# Altium project Nixie_clock.PrjPcb
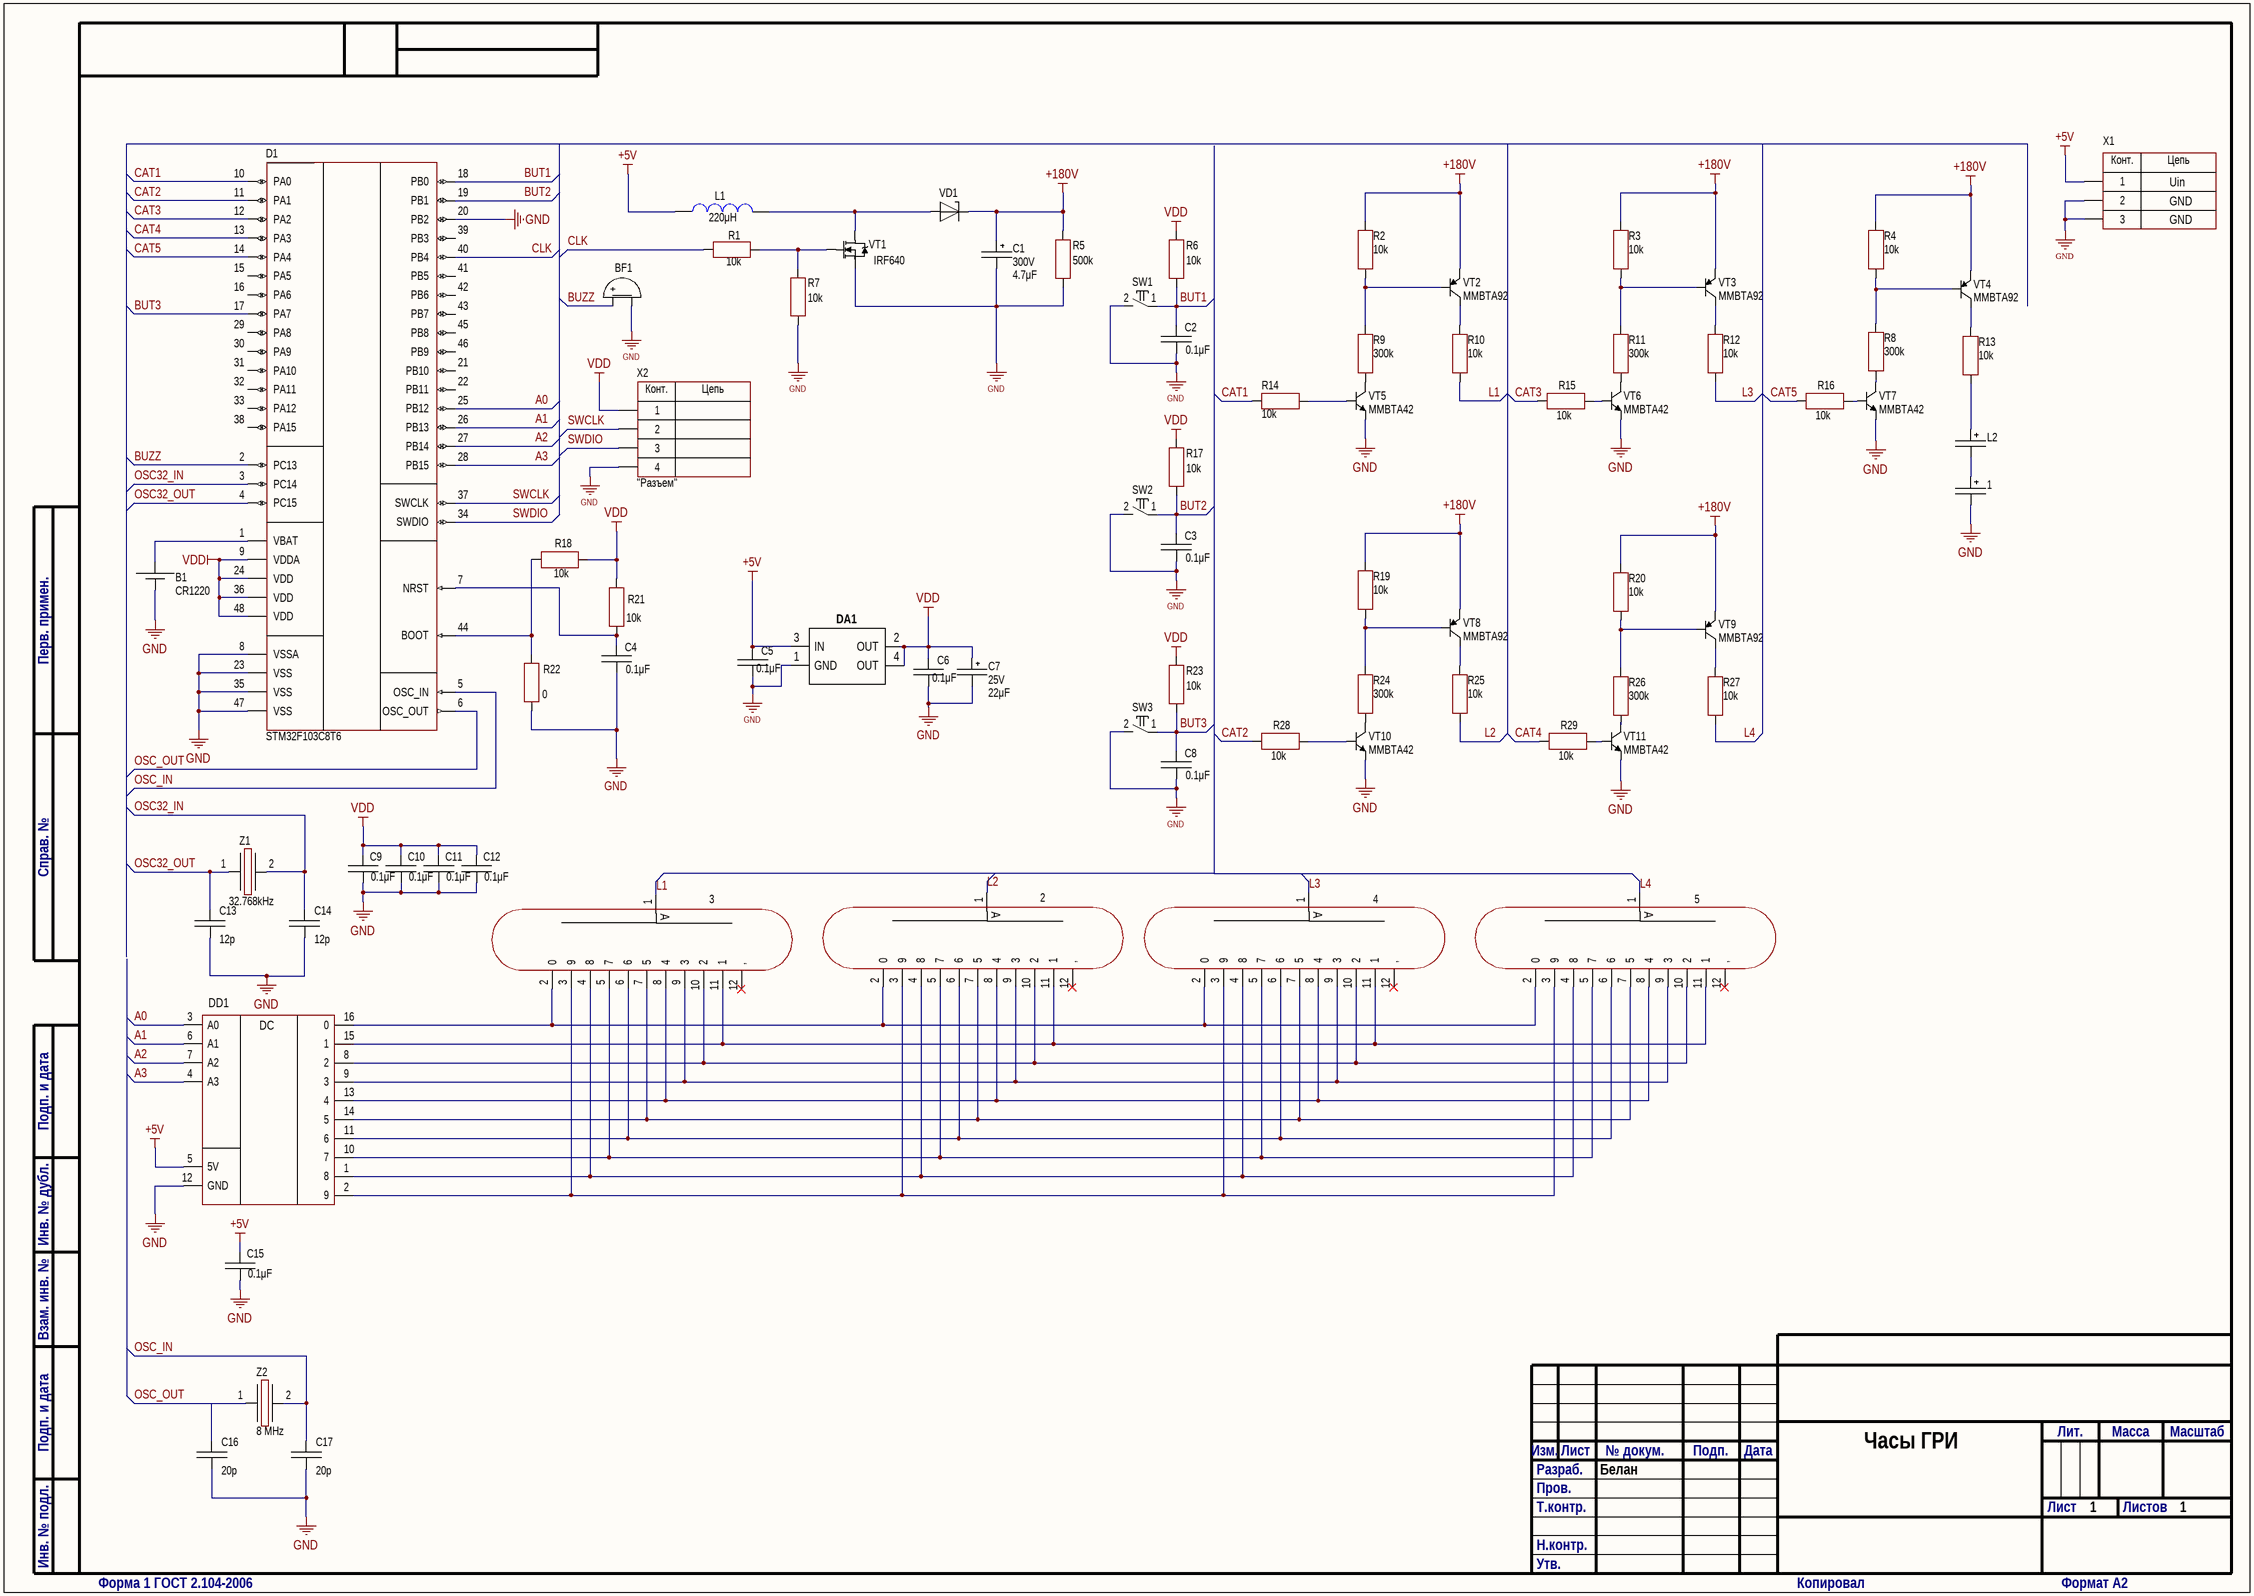
[diagram p0: NixieClock.SchDoc]
1 sheet, 77 parts. Net scope: global (net labels, ports and power ports of the same name join across sheets).
Board file: NixieClock.PcbDoc

## Sheet NixieClock.SchDoc: Часы ГРИ
size 594 x 420 mm; Author: Белан; SheetNumber: 1; SheetTotal: 1

### Parts
1  (no value)  [CAP: D5C2H11]
2  IN-12  (value not drawn)
3  IN-12  (value not drawn)
4  IN-12  (value not drawn)
5  IN-12  (value not drawn)
B1  CommentText: CR1220  [BAT: CR1220]
BF1  (no value)  [BUZ: AI-1223-TWT-3V-2-R]
C1  value 4.7μF  Voltage: 300V  [CAP: D8C3.5H12]
C2  value 0.1μF  [CAP: 0805]
C3  value 0.1μF  [CAP: 0805]
C4  value 0.1μF  [CAP: 0805]
C5  value 0.1μF  [CAP: 0805]
C6  value 0.1μF  [CAP: 0805]
C7  value 22μF  Voltage: 25V  [CAP: TANTAL-C]
C8  value 0.1μF  [CAP: 0805]
C9  value 0.1μF  [CAP: 0805]
C10  value 0.1μF  [CAP: 0805]
C11  value 0.1μF  [CAP: 0805]
C12  value 0.1μF  [CAP: 0805]
C13  value 12p  [CAP: 0805]
C14  value 12p  [CAP: 0805]
C15  value 0.1μF  [CAP: 0805]
C16  value 20p  [CAP: 0805]
C17  value 20p  [CAP: 0805]
D1  (no value)  [48-LQFP]
DA1  SPX1117M3-3-3  [SOT-223]  (value not drawn)
DD1  K155ID1  [16-DIP]  (value not drawn)
L1  value 220μH  [IND: SDR1006]
L2  (no value)  [CAP: D5C2H11]
R1  value 10k  [RES: 0805]
R2  value 10k  [RES: 0805]
R3  value 10k  [RES: 0805]
R4  value 10k  [RES: 0805]
R5  value 500k  [RES: 0805]
R6  value 10k  [RES: 0805]
R7  value 10k  [RES: 0805]
R8  value 300k  [RES: 0805]
R9  value 300k  [RES: 0805]
R10  value 10k  [RES: 0805]
R11  value 300k  [RES: 0805]
R12  value 10k  [RES: 0805]
R13  value 10k  [RES: 0805]
R14  value 10k  [RES: 0805]
R15  value 10k  [RES: 0805]
R16  value 10k  [RES: 0805]
R17  value 10k  [RES: 0805]
R18  value 10k  [RES: 0805]
R19  value 10k  [RES: 0805]
R20  value 10k  [RES: 0805]
R21  value 10k  [RES: 0805]
R22  value 0  [RES: 0805]
R23  value 10k  [RES: 0805]
R24  value 300k  [RES: 0805]
R25  value 10k  [RES: 0805]
R26  value 300k  [RES: 0805]
R27  value 10k  [RES: 0805]
R28  value 10k  [RES: 0805]
R29  value 10k  [RES: 0805]
SW1  (no value)  [BUT: 6x6]
SW2  (no value)  [BUT: 6x6]
SW3  (no value)  [BUT: 6x6]
VD1  (no value)  [DIODE: SOD123]
VT1  PartNumber: IRF640  [D2PAK]
VT2  PartNumber: MMBTA92  [SOT23]
VT3  PartNumber: MMBTA92  [SOT23]
VT4  PartNumber: MMBTA92  [SOT23]
VT5  PartNumber: MMBTA42  [SOT23]
VT6  PartNumber: MMBTA42  [SOT23]
VT7  PartNumber: MMBTA42  [SOT23]
VT8  PartNumber: MMBTA92  [SOT23]
VT9  PartNumber: MMBTA92  [SOT23]
VT10  PartNumber: MMBTA42  [SOT23]
VT11  PartNumber: MMBTA42  [SOT23]
X1  (no value)  [KLS1-DC-025V]
X2  CommentText: "Разъем"  [CON: PLS-4]
Z1  Frequency: 32.768kHz  [OSC: 3215]
Z2  Frequency: 8 MHz  [OSC: 3215]

### Nets
+5V: C5.2 C15.2 DA1.3(IN) DD1.5(5V) L1.2 X1.1
+180V: C1.1 R2.2 R3.2 R4.2 R5.1 R19.2 R20.2 VD1.2(C) VT2.2(E) VT3.2(E) VT4.2(E) VT8.2(E) VT9.2(E)
GND: 1.2 B1.2(-) BF1.2(-) C1.2 C2.1 C3.1 C4.1 C5.1 C6.1 C7.2 C8.1 C9.1 C10.1 C11.1 C12.1 C13.1 C14.1 C15.1 C16.1 C17.1 D1.8(VSSA) D1.20(PB2) D1.23(VSS) D1.35(VSS) D1.47(VSS) DA1.1(GND) DD1.12(GND) R5.2 R7.2 R22.1 SW1.2 SW2.2 SW3.2 VT1.3(S) VT5.2(E) VT6.2(E) VT7.2(E) VT10.2(E) VT11.2(E) X1.2 X1.3 X2.4
VDD: C6.2 C7.1 C9.2 C10.2 C11.2 C12.2 D1.9(VDDA) D1.24(VDD) D1.36(VDD) D1.48(VDD) DA1.2(OUT) DA1.4(OUT) R6.1 R17.1 R18.2 R21.2 R23.1 X2.1
A0: D1.25(PB12) DD1.3(A0)
A1: D1.26(PB13) DD1.6(A1)
A2: D1.27(PB14) DD1.7(A2)
A3: D1.28(PB15) DD1.4(A3)
BUT1: C2.2 D1.18(PB0) R6.2 SW1.1
BUT2: C3.2 D1.19(PB1) R17.2 SW2.1
BUT3: C8.2 D1.17(PA7) R23.2 SW3.1
BUZZ: BF1.1(+) D1.2(PC13)
CAT1: D1.10(PA0) R14.1
CAT2: D1.11(PA1) R28.1
CAT3: D1.12(PA2) R15.1
CAT4: D1.13(PA3) R29.1
CAT5: D1.14(PA4) R16.1
CLK: D1.40(PB4) R1.2
L1: 3.1(A) R10.1
L2: 2.1(A) R25.1
L3: 4.1(A) R12.1
L4: 5.1(A) R27.1
OSC32_IN: C14.2 D1.3(PC14) Z1.2
OSC32_OUT: C13.2 D1.4(PC15) Z1.1
OSC_IN: C17.2 D1.5(OSC_IN) Z2.2
OSC_OUT: C16.2 D1.6(OSC_OUT) Z2.1
SWCLK: D1.37(SWCLK) X2.2
SWDIO: D1.34(SWDIO) X2.3
Net1_1: 1.1 L2.2
Net2_2: 2.2(0) 3.2(0) 4.2(0) 5.2(0) DD1.16(0)
Net2_3: 2.3(9) 3.3(9) 4.3(9) 5.3(9) DD1.2(9)
Net2_4: 2.4(8) 3.4(8) 4.4(8) 5.4(8) DD1.1(8)
Net2_5: 2.5(7) 3.5(7) 4.5(7) 5.5(7) DD1.10(7)
Net2_6: 2.6 3.6 4.6 5.6 DD1.11(6)
Net2_7: 2.7(5) 3.7(5) 4.7(5) 5.7(5) DD1.14(5)
Net2_8: 2.8(4) 3.8(4) 4.8(4) 5.8(4) DD1.13(4)
Net2_9: 2.9(3) 3.9(3) 4.9(3) 5.9(3) DD1.9(3)
Net2_10: 2.10(2) 3.10(2) 4.10(2) 5.10(2) DD1.8(2)
Net2_11: 2.11(1) 3.11(1) 4.11(1) 5.11(1) DD1.15(1)
NetB1_1: B1.1(+) D1.1(VBAT)
NetC4_2: C4.2 D1.7(NRST) R21.1
NetD1_44: D1.44(BOOT) R18.1 R22.2
NetL1_1: L1.1 VD1.1(A) VT1.2(D)
NetL2_1: L2.1 R13.1
NetR1_1: R1.1 R7.1 VT1.1(G)
NetR2_1: R2.1 R9.2 VT2.1(B)
NetR3_1: R3.1 R11.2 VT3.1(B)
NetR4_1: R4.1 R8.2 VT4.1(B)
NetR8_1: R8.1 VT7.3(C)
NetR9_1: R9.1 VT5.3(C)
NetR10_2: R10.2 VT2.3(C)
NetR11_1: R11.1 VT6.3(C)
NetR12_2: R12.2 VT3.3(C)
NetR13_2: R13.2 VT4.3(C)
NetR14_2: R14.2 VT5.1(B)
NetR15_2: R15.2 VT6.1(B)
NetR16_2: R16.2 VT7.1(B)
NetR19_1: R19.1 R24.2 VT8.1(B)
NetR20_1: R20.1 R26.2 VT9.1(B)
NetR24_1: R24.1 VT10.3(C)
NetR25_2: R25.2 VT8.3(C)
NetR26_1: R26.1 VT11.3(C)
NetR27_2: R27.2 VT9.3(C)
NetR28_2: R28.2 VT10.1(B)
NetR29_2: R29.2 VT11.1(B)

Not connected (* = marked no-connect by the designer): 2 12(,)*; 3 12(,)*; 4 12(,)*; 5 12(,)*; D1 15(PA5) 16(PA6) 21(PB10) 22(PB11) 29(PA8) 30(PA9) 31(PA10) 32(PA11) 33(PA12) 38(PA15) 39(PB3) 41(PB5) 42(PB6) 43(PB7) 45(PB8) 46(PB9)

### Notes on the sheet
- Перв. примен.
- Справ. №
- Подп. и дата
- Инв. № дубл.
- Взам. инв. №
- Разраб.
- Изм.
- Лист
- № докум.
- Подп.
- Дата
- Лит.
- Масса
- Масштаб
- Пров.
- Т.контр.
- Листов
- Инв. № подл.
- Н.контр.
- Утв.
- Форма 1 ГОСТ 2.104-2006
- Копировал
- Формат А2
- (in symbol Connector_KLS1-DC-025v) Конт.; Цепь; Uin; GND
- (in symbol IN-12) А
- (in symbol K155ID1) DC
- (in symbol PLS-4) Конт.; Цепь

### Library data of the parts
1 L2 = Aluminium: Manufacturer: Wurth; PartNumber: 860080475013; ValueManufacturerPartNumber: Aluminium capacitor, 330μF, 25V, ±20%, 54mOhm, 14x10x5 mm, -55...+105°C; TypeCapacitor: Aluminium capacitor; Tolerance: ±20%; Impedance: 54mOhm; Voltage: 25V; Value: 330μF; Package: 14x10x5 mm; HelpURL: https://www.digikey.com/product-detail/en/wurth-electronics-inc/860080475013/732-9029-1-ND/5728972; Temperature: -55...+105°C
2-5 = IN-12: IN-12 Nixie Tube; Manufacturer: USSR; PartNumber: ИН-12; ValueManufacturerPartNumber: IN-12
B1 = Connector_CR1220: Manufacturer: Q&J; ValueManufacturerPartNumber: Single battery CR1220; PartNumber: CR1220-2; HelpURL: https://lcsc.com/product-detail/Battery-Holders-Clips-Contacts_CR1220-2-Battery-horizontal-base_C70381.html; TypeConnector: Single battery CR1220
BF1 = Buzzer: Manufacturer: PUI Audio; ValueManufacturerPartNumber: DIP switch, 2.73 kHz, 3VDC, 80mA, -20...+70°C; PartNumber: AT-0927-TT-6-R; TypeBuzzer: DIP switch; VoltageMax: 3VDC; Frequency: 2.73 kHz; CurrentMax: 80mA; HelpURL: https://www.digikey.com/products/en?keywords=AT-0927-TT-6-R; Temperature: -20...+70°C
C1 = Aluminium: Manufacturer: Wurth; PartNumber: 860080475013; ValueManufacturerPartNumber: Aluminium capacitor, 4.7μF, 300V, ±20%, 54mOhm, 14x10x5 mm, -55...+105°C; TypeCapacitor: Aluminium capacitor; Tolerance: ±20%; Impedance: 54mOhm; Package: 14x10x5 mm; HelpURL: https://www.digikey.com/product-detail/en/wurth-electronics-inc/860080475013/732-9029-1-ND/5728972; Temperature: -55...+105°C
C2-C6 C8-C12 C15 = Ceramic_0805: Manufacturer: Yageo; PartNumber: CC0805KRX7R7BB104; ValueManufacturerPartNumber: Ceramic capacitor, 0.1μF, X7R, ±10%, 16V, 0805, -55...+125°C; TypeCapacitor: Ceramic capacitor; Tolerance: ±10%; TypeDielectric: X7R; Voltage: 16V; Package: 0805; HelpURL: https://www.digikey.com/product-detail/en/yageo/CC0805KRX7R7BB104/311-1142-1-ND/303052; Temperature: -55...+125°C
C7 = Tantal_C: Manufacturer: AVX; PartNumber: F931E226MCC; ValueManufacturerPartNumber: Tantalum capacitor, 22μF, 25V, ±10%, 1.1Ohm, case C (6032), -55...+125°C; Impedance: 1.1Ohm; Tolerance: ±10%; TypeDielectric: X7R; TypeCapacitor: Tantalum capacitor; Package: case C (6032); HelpURL: https://www.digikey.com/product-detail/en/avx-corporation/F931E226MCC/478-8314-1-ND/4006045; Temperature: -55...+125°C
C13 C14 = Ceramic_0805: Manufacturer: Yageo; PartNumber: CC0805KRX7R7BB104; ValueManufacturerPartNumber: Ceramic capacitor, 12p, X7R, ±10%, 16V, 0805, -55...+125°C; TypeCapacitor: Ceramic capacitor; Tolerance: ±10%; TypeDielectric: X7R; Voltage: 16V; Package: 0805; HelpURL: https://www.digikey.com/product-detail/en/yageo/CC0805KRX7R7BB104/311-1142-1-ND/303052; Temperature: -55...+125°C
C16 C17 = Ceramic_0805: Manufacturer: Yageo; PartNumber: CC0805KRX7R7BB104; ValueManufacturerPartNumber: Ceramic capacitor, 20p, X7R, ±10%, 16V, 0805, -55...+125°C; TypeCapacitor: Ceramic capacitor; Tolerance: ±10%; TypeDielectric: X7R; Voltage: 16V; Package: 0805; HelpURL: https://www.digikey.com/product-detail/en/yageo/CC0805KRX7R7BB104/311-1142-1-ND/303052; Temperature: -55...+125°C
D1 = STM32F103C8T6: Cortex-M3; Manufacturer: STMicroelectronics; ValueManufacturerPartNumber: IC microcontroller, 32-Bit, Cortex-M3, 72MHz, 64KB, 20KB, 2...3.6V, -40...+85°C, 48-LQFP; Supply: 2...3.6V; Speed: 72MHz; CoreSize: 32-Bit; MemoryROM: 64KB; MemoryRAM: 20KB; HelpURL: https://www.digikey.com/product-detail/en/stmicroelectronics/STM32F103C8T6TR/497-17666-1-ND/7804402; Package: 48-LQFP; ComponentType: IC microcontroller; Temperature: -40...+85°C; CoreProcessor: Cortex-M3; PartNumber: STM32F103C8T6
DA1 = SPX1117M3-3-3: Стабилизатор напряжения; ManufacturerPartNumber: Микросхема SPX1117M3-3-3 Sipex Corporation; Value: 0; ГОСТ: Sipex Corporation; Класс: Микросхема; Ключ Imbase: i60026C50B6529001B29; Вид приемки: 1; Применяемость: +_ВЭО1-6,+_Н,+_Т,+_М,Г,Г_Н,Г_О,ТБИ,ТБК,У,З,ТФ,ТФ_М; Кол-во паек SMD: 12; Part Number: SPX1117M3-3-3; Nominal: 0; ComponentLink1Url: http://is/datasheet/files/AD_Library_Pdf/Microchip/SPX1117.PDF; ComponentLink1Description: DataSheet; Device Type: Микросхема; Кол-во паек объемный: 0
DD1 = K155ID1: Двоично-десятичный дешифpатоp; Manufacturer: К155ИД1; Package: DIP16; HelpUrl: https://static.chipdip.ru/lib/918/DOC005918323.pdf
L1 = Inductor_SDR1006: Manufacturer: Bourns; PartNumber: SDR1006-221KL; ValueManufacturerPartNumber: Fixed inductor, 220μH, ±10%, SDR0805, 660mA, -40...+125°C; TypeInductor: Fixed inductor; MaxCurrent: 660mA; Tolerance: ±10%; Package: SDR0805; HelpURL: https://www.digikey.com/product-detail/en/bourns-inc/SDR1006-221KL/SDR1006-221KLCT-ND/2127211; Temperature: -40...+125°C
R1-R4 R6 R7 R10 R12-R21 R23 R25 R27-R29 = Resistor_0805: Manufacturer: Yageo; PartNumber: RC0805JR-07100RL; ValueManufacturerPartNumber: Resistor film, 10k, ±5%, 0805, 0.125W, -55...+125°C; TypeResistor: Resistor film; Power: 0.125W; Tolerance: ±5%; Package: 0805; HelpURL: https://www.digikey.com/product-detail/en/yageo/RC0805JR-07100RL/311-100ARCT-ND/731185; Temperature: -55...+125°C
R5 = Resistor_0805: Manufacturer: Yageo; PartNumber: RC0805JR-07100RL; ValueManufacturerPartNumber: Resistor film, 500k, ±5%, 0805, 0.125W, -55...+125°C; TypeResistor: Resistor film; Power: 0.125W; Tolerance: ±5%; Package: 0805; HelpURL: https://www.digikey.com/product-detail/en/yageo/RC0805JR-07100RL/311-100ARCT-ND/731185; Temperature: -55...+125°C
R8 R9 R11 R24 R26 = Resistor_0805: Manufacturer: Yageo; PartNumber: RC0805JR-07100RL; ValueManufacturerPartNumber: Resistor film, 300k, ±5%, 0805, 0.125W, -55...+125°C; TypeResistor: Resistor film; Power: 0.125W; Tolerance: ±5%; Package: 0805; HelpURL: https://www.digikey.com/product-detail/en/yageo/RC0805JR-07100RL/311-100ARCT-ND/731185; Temperature: -55...+125°C
R22 = Resistor_0805: Manufacturer: Yageo; PartNumber: RC0805JR-07100RL; ValueManufacturerPartNumber: Resistor film, 0, ±5%, 0805, 0.125W, -55...+125°C; TypeResistor: Resistor film; Power: 0.125W; Tolerance: ±5%; Package: 0805; HelpURL: https://www.digikey.com/product-detail/en/yageo/RC0805JR-07100RL/311-100ARCT-ND/731185; Temperature: -55...+125°C
SW1-SW3 = Button_3x4x2_SMT: SMT 3*4*2 2PIN; Manufacturer: xin cheng electronic; CommentText: "Кнопка"; HelpURL: https://aliexpress.ru/item/32309509976.html?spm=a2g0v.12010612.8148356.51.441f61b1yUlL0Q; ValueManufacturerPartNumber: =TypeButton+', '+Package; PartNumber: 3*4*2 2PIN; Package: 3*4*2mm
VD1 = Zener_single: Manufacturer: Diodes Incorporated; ValueManufacturerPartNumber: Zener diode, 5.1V, 500mW, 0.9V, 17Ohm, SOD-123, -55...+150°C; PartNumber: MMSZ5231B-7-F; TypeDiode: Zener diode; Current: 500mW; VoltageDrop: 0.9V; RecoveryTime: 17Ohm; Voltage: 5.1V; Package: SOD-123; HelpURL: https://www.digikey.com/product-detail/en/diodes-incorporated/MMSZ5231B-7-F/MMSZ5231B-FDICT-ND/755506; Temperature: -55...+150°C
VT1 = MOSFET_N_123: Manufacturer: Infineon Technologies; ValueManufacturerPartNumber: MOSFET N-channel transistor, 80V, 7A, 9.1nC, 2.5W, 34mOhm, 756pF, 8-TDSON, -55...+150°C; TypeTransistor: MOSFET N-channel transistor; VoltageDS: 80V; CurrentDS: 7A; RDS: 34mOhm; GateCharge: 9.1nC; InputCapacitor: 756pF; MaxPower: 2.5W; Package: 8-TDSON; HelpURL: https://www.digikey.com/product-detail/en/infineon-technologies/BSC340N08NS3GATMA1/BSC340N08NS3GATMA1TR-ND/2080655; Temperature: -55...+150°C
VT2-VT4 VT8 VT9 = BJT_PNP_123: Manufacturer: ON Semiconductor; ValueManufacturerPartNumber: PNP transistor, 45V, 100mA, 100MHz, 300mW, 0.65V, 220, SOT-23, -55...+125°C; TypeTransistor: PNP transistor; VoltageCE: 45V; CurrentCE: 100mA; VoltageSaturation: 0.65V; Frequency: 100MHz; CurrentGain: 220; MaxPower: 300mW; Package: SOT-23; HelpURL: https://www.digikey.com/product-detail/en/on-semiconductor/BC857BLT3G/BC857BLT3GOSCT-ND/2704963; Temperature: -55...+125°C
VT5-VT7 VT10 VT11 = BJT_NPN_132: Manufacturer: ON Semiconductor; ValueManufacturerPartNumber: NPN transistor, 45V, 100mA, 100MHz, 300mW, 0.6V, 420, SOT-23, -55...+125°C; TypeTransistor: NPN transistor; VoltageCE: 45V; CurrentCE: 100mA; VoltageSaturation: 0.6V; Frequency: 100MHz; CurrentGain: 420; MaxPower: 300mW; Package: SOT-23; HelpURL: https://www.digikey.com/product-detail/en/on-semiconductor/BC847CLT1G/BC847CLT1GOSCT-ND/917836; Temperature: -55...+125°C
X1 = Connector_KLS1-DC-025v: Manufacturer: TE Connectivity; ValueManufacturerPartNumber: Connector, 2pin, 9.53mm, 300VAC, 25A; PartNumber: KLS1-DC-005A; VoltageMax: 300VAC; Pitch: 9.53mm; CurrentMax: 25A; Multichannel: 2pin; CommentText: "Разъем"; TypeConnector: Connector
X2 = PLS-4: Manufacturer: Connfly; ValueManufacturerPartNumber: Connector, 4pin, 2.54mm, 500VAC, 3A; TypeConnector: Connector; VoltageMax: 500VAC; Pitch: 2.54mm; CurrentMax: 3A; Multichannel: 4pin; HelpURL: https://www.chipdip.ru/product/pls-4; PartNumber: PLS-4
Z1 = Crystal_3215: Manufacturer: Epson; PartNumber: FC-135 32.7680KA-A5; ValueManufacturerPartNumber: Crystal, 32.768kHz, 12.5pF, ±20ppm, case 3215, -40...+85°C; LoadCapacitance: 12.5pF; Tolerance: ±20ppm; Package: case 3215; HelpURL: https://www.digikey.com/product-detail/en/epson/FC-135-32.7680KA-A5/SER4103CT-ND/6188447; Temperature: -40...+85°C; TypeOscilator: Crystal
Z2 = Crystal_3215: Manufacturer: Epson; PartNumber: FC-135 32.7680KA-A5; ValueManufacturerPartNumber: Crystal, 8 MHz, 12.5pF, ±20ppm, case 3215, -40...+85°C; LoadCapacitance: 12.5pF; Tolerance: ±20ppm; Package: case 3215; HelpURL: https://www.digikey.com/product-detail/en/epson/FC-135-32.7680KA-A5/SER4103CT-ND/6188447; Temperature: -40...+85°C; TypeOscilator: Crystal